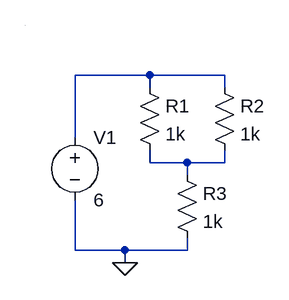
[diagram p0: schematic ParallelInSeries.asc]
ParallelInSeries.asc, the LTspice schematic file:
Version 4
SHEET 1 880 680
WIRE 160 64 64 64
WIRE 256 64 160 64
WIRE 160 80 160 64
WIRE 256 80 256 64
WIRE 64 144 64 64
WIRE 160 176 160 160
WIRE 208 176 160 176
WIRE 256 176 256 160
WIRE 256 176 208 176
WIRE 208 192 208 176
WIRE 64 288 64 224
WIRE 128 288 64 288
WIRE 208 288 208 272
WIRE 208 288 128 288
WIRE 128 304 128 288
WIRE 0 0 0 0
FLAG 128 304 0
SYMBOL res 144 64 R0
SYMATTR InstName R1
SYMATTR Value 1k
SYMBOL res 240 64 R0
SYMATTR InstName R2
SYMATTR Value 1k
SYMBOL res 192 176 R0
SYMATTR InstName R3
SYMATTR Value 1k
SYMBOL voltage 64 128 R0
SYMATTR InstName V1
SYMATTR Value 6

The netlist it stands for:
* ParallelInSeries.asc
R1 N001 N002 1k
R2 N001 N002 1k
R3 N002 0 1k
V1 N001 0 6
.backanno
.end